# Altium schematic sheet AV.SchDoc
size A; SheetNumber: 3; SheetTotal: 7
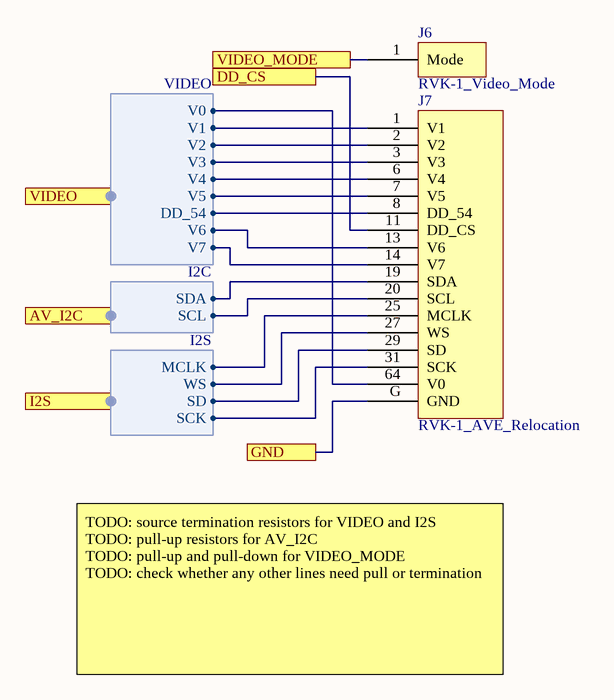
[diagram p0: AV.SchDoc]

## Parts
J6  RVK-1_Video_Mode  [RVK-1_Video_Mode_via]
J7  RVK-1_AVE_Relocation  [RVK-1_AVE_Vias]

## Ports
AV_I2C (harness I2C), DD_CS, GND, I2S (harness I2S), VIDEO (harness VIDEO), VIDEO_MODE

## Harnesses
VIDEO: V0, V1, V2, V3, V4, V5, V6, V7, DD_54
I2C: SDA, SCL
I2S: MCLK, SCK, WS, SD

## Nets
DD_CS: J7.11(DD_CS) ; port DD_CS
GND: J7.G(GND) ; port GND
VIDEO_MODE: J6.1(Mode) ; port VIDEO_MODE
NetJ7_1: J7.1(V1) ; port VIDEO.V1
NetJ7_2: J7.2(V2) ; port VIDEO.V2
NetJ7_3: J7.3(V3) ; port VIDEO.V3
NetJ7_6: J7.6(V4) ; port VIDEO.V4
NetJ7_7: J7.7(V5) ; port VIDEO.V5
NetJ7_8: J7.8(DD_54) ; port VIDEO.DD_54
NetJ7_13: J7.13(V6) ; port VIDEO.V6
NetJ7_14: J7.14(V7) ; port VIDEO.V7
NetJ7_19: J7.19(SDA) ; port AV_I2C.SDA
NetJ7_20: J7.20(SCL) ; port AV_I2C.SCL
NetJ7_25: J7.25(MCLK) ; port I2S.MCLK
NetJ7_27: J7.27(WS) ; port I2S.WS
NetJ7_29: J7.29(SD) ; port I2S.SD
NetJ7_31: J7.31(SCK) ; port I2S.SCK
NetJ7_64: J7.64(V0) ; port VIDEO.V0

## Notes on the sheet
- TODO: source termination resistors for VIDEO and I2S
  TODO: pull-up resistors for AV_I2C
  TODO: pull-up and pull-down for VIDEO_MODE
  TODO: check whether any other lines need pull or termination